# EAGLE design 11_RCL (EAGLE 7.5.0)
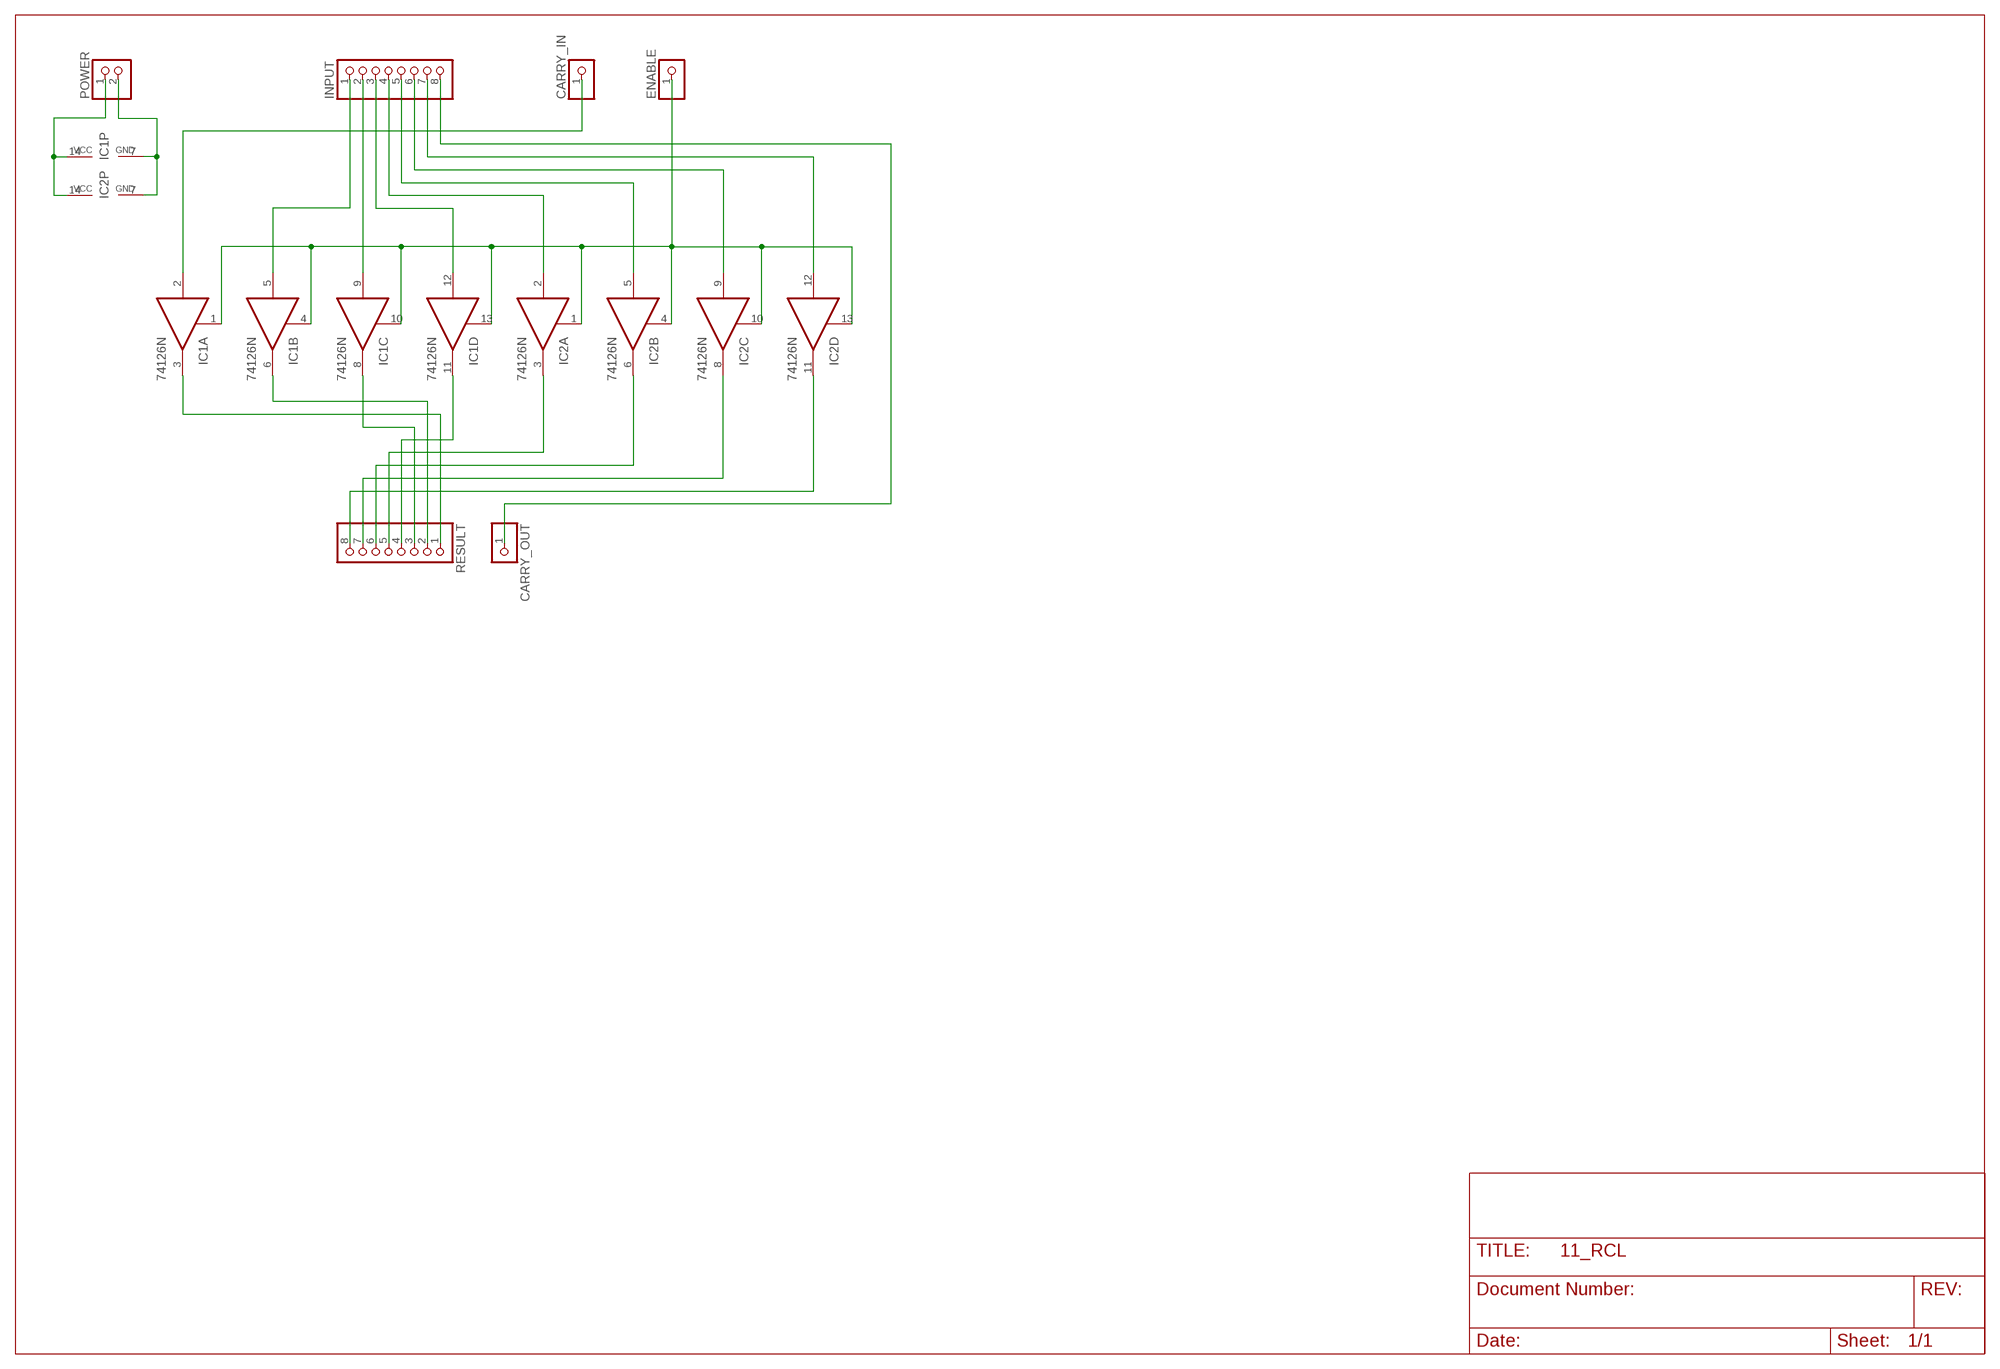
[diagram p0: schematic, sheet 1]

## Parts
CARRY_IN  PINHD-1X1  [1X01]
CARRY_OUT  PINHD-1X1  [1X01]
ENABLE  PINHD-1X1  [1X01]
IC1  74126N  [DIL14]
IC2  74126N  [DIL14]
INPUT  PINHD-1X8  [1X08]
POWER  PINHD-1X2  [1X02]
RESULT  PINHD-1X8  [1X08]

## Nets
GND: IC1.7(P:GND) IC2.7(P:GND) POWER.2
N$1: CARRY_IN.1 IC1.2(A:I)
N$2: IC1.3(A:O) RESULT.1
N$3: IC1.5(B:I) INPUT.1
N$4: IC1.6(B:O) RESULT.2
N$5: IC1.9(C:I) INPUT.2
N$6: IC1.12(D:I) INPUT.3
N$7: IC2.2(A:I) INPUT.4
N$8: IC2.5(B:I) INPUT.5
N$9: IC2.9(C:I) INPUT.6
N$10: IC2.12(D:I) INPUT.7
N$11: IC1.8(C:O) RESULT.3
N$12: IC1.11(D:O) RESULT.4
N$13: IC2.3(A:O) RESULT.5
N$14: IC2.6(B:O) RESULT.6
N$15: IC2.8(C:O) RESULT.7
N$16: IC2.11(D:O) RESULT.8
N$17: CARRY_OUT.1 INPUT.8
N$18: ENABLE.1 IC1.1(A:OE) IC1.4(B:OE) IC1.10(C:OE) IC1.13(D:OE) IC2.1(A:OE) IC2.4(B:OE) IC2.10(C:OE) IC2.13(D:OE)
VCC: IC1.14(P:VCC) IC2.14(P:VCC) POWER.1

## Library data of the parts
CARRY_IN CARRY_OUT ENABLE = pinhead:PINHD-1X1: PIN HEADER
IC1 IC2 = 74xx-eu:74*126: Quad bus BUFFER, 3-state
INPUT RESULT = pinhead:PINHD-1X8: PIN HEADER
POWER = pinhead:PINHD-1X2: PIN HEADER

## Board
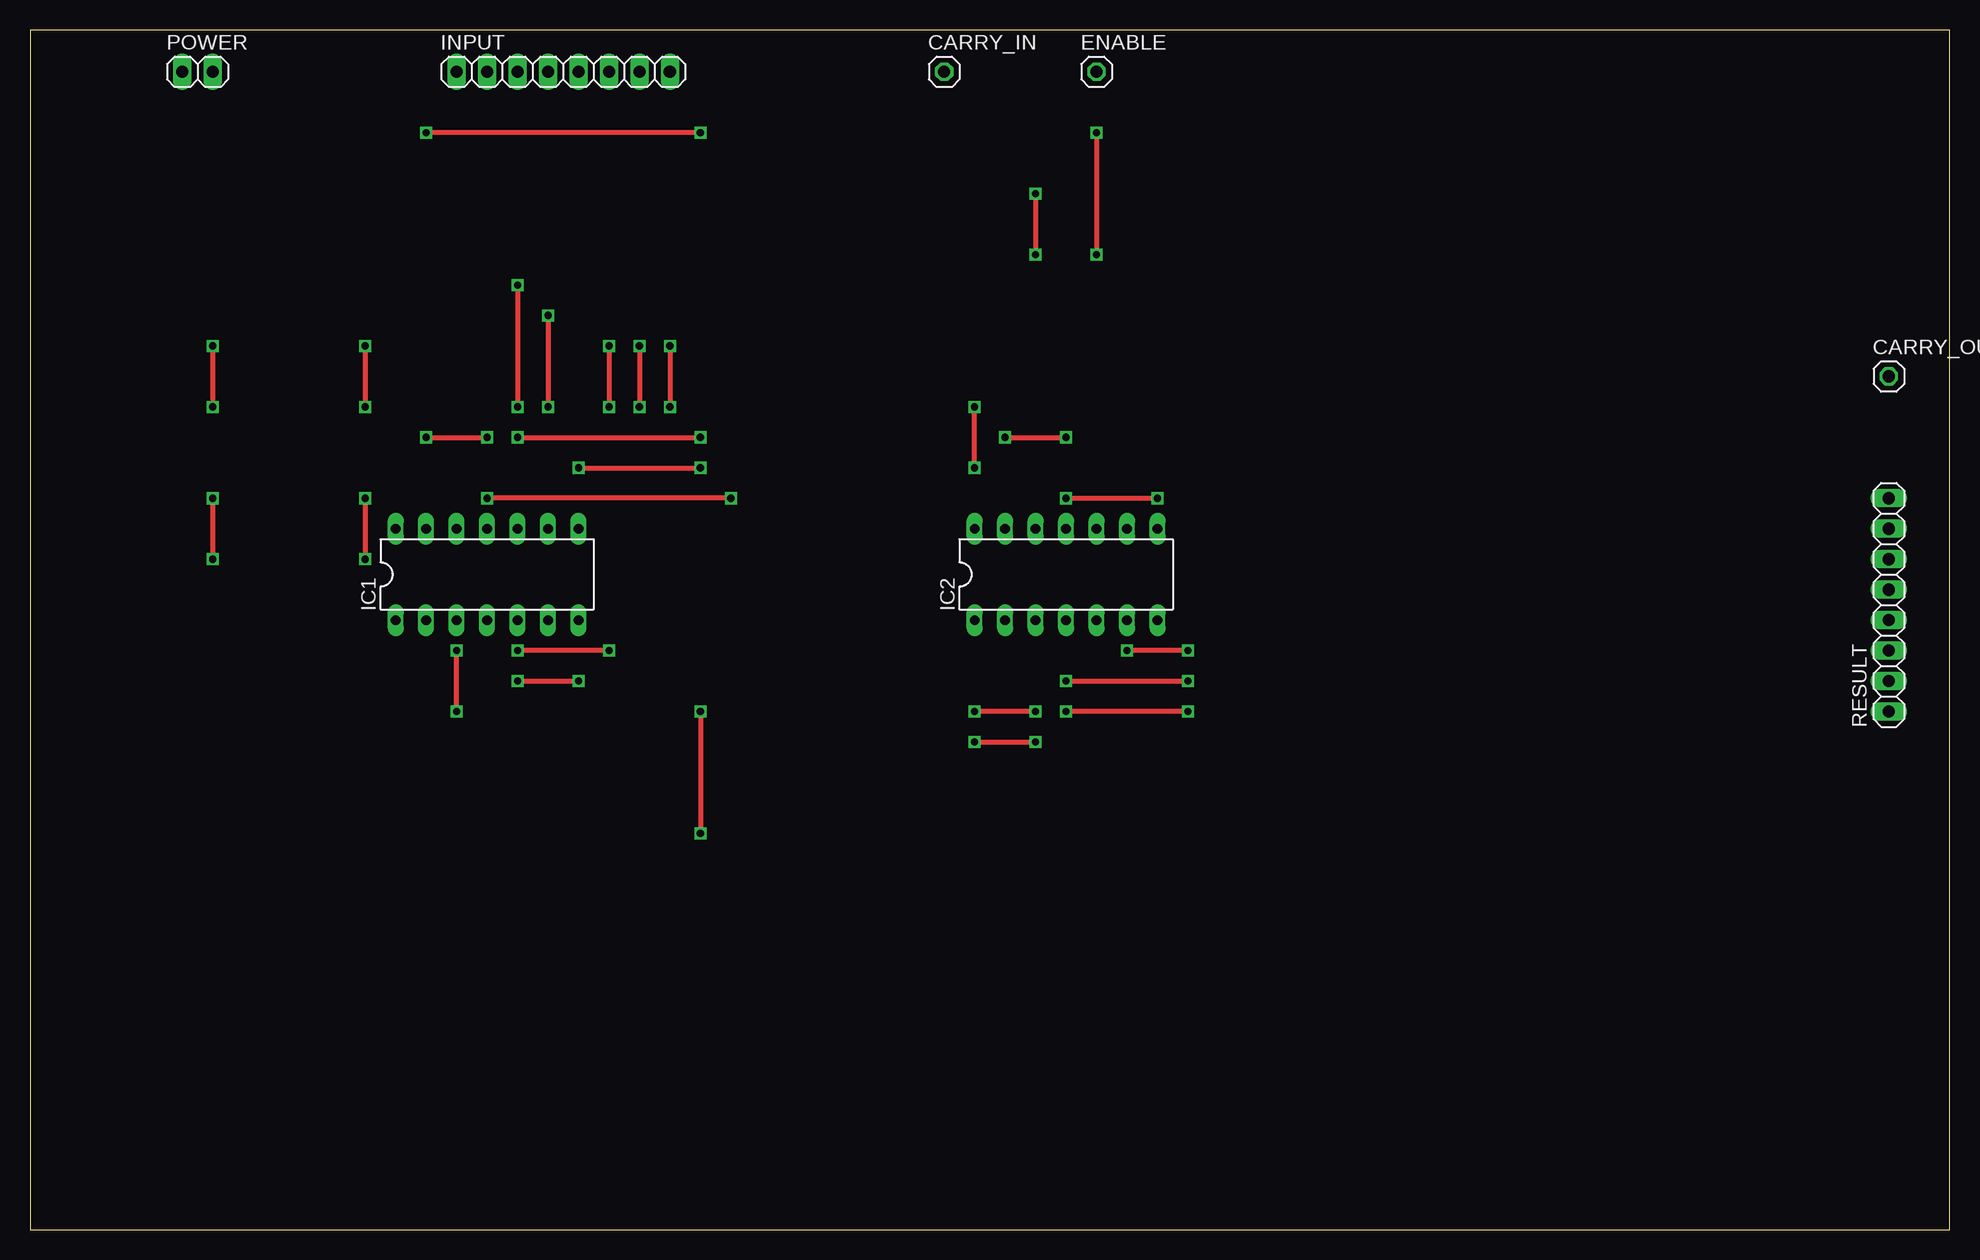
[diagram p1: board, top side]
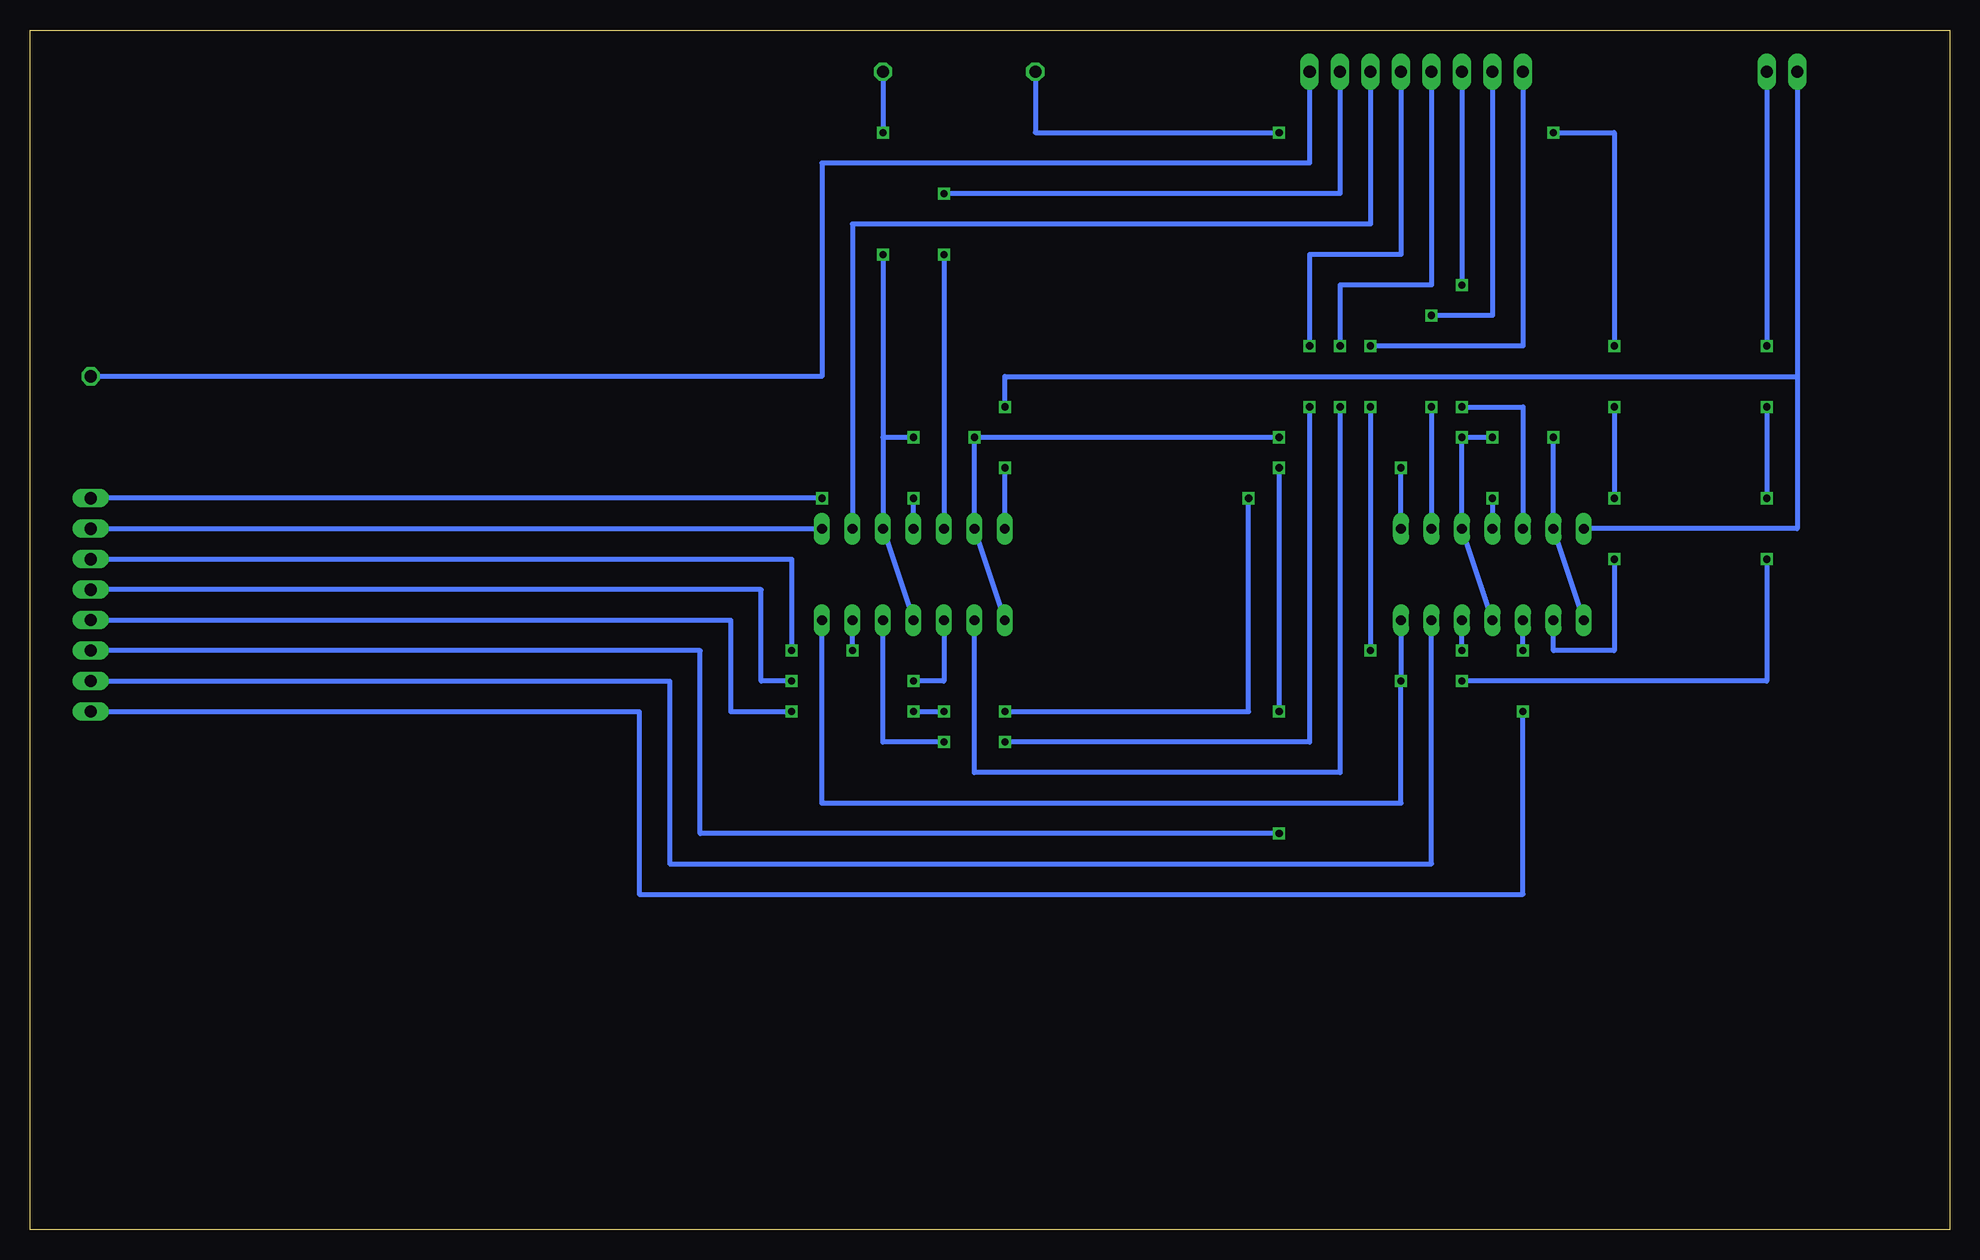
[diagram p2: board, bottom side, seen from below]

Size 160 x 100 mm. Coordinates in mm from the lower left corner, seen from the top.
Outline: 0,0 160,0 160,100 0,100 0,0
Copper layers (1*16): Top 0.035mm / dielectric 1.5mm / Bottom 0.035mm
Design rules "default": minimum track width 10mil, minimum drill 24mil, track to track 8mil, track to pad 8mil, pad to pad 8mil, via to via 8mil, smd to smd 8mil, copper to edge 40mil, drill to drill 8mil, minimum pad ring 10mil, minimum via ring 8mil, stop-mask expansion 4mil, vias tented up to drill 0mil, thermal gap 10mil

### Footprints (pad centres in the part's own frame; a part is rotated, then mirrored left to right if it is on the bottom)
1X01 = drill 1.016 octagon: 1 0,0
DIL14 = drill 0.813 long: 1 -7.62,-3.81; 2 -5.08,-3.81; 3 -2.54,-3.81; 4 0,-3.81; 5 2.54,-3.81; 6 5.08,-3.81; 7 7.62,-3.81; 8 7.62,3.81; 9 5.08,3.81; 10 2.54,3.81; 11 0,3.81; 12 -2.54,3.81; 13 -5.08,3.81; 14 -7.62,3.81
1X08 = drill 1.016 long: 1 -8.89,0; 2 -6.35,0; 3 -3.81,0; 4 -1.27,0; 5 1.27,0; 6 3.81,0; 7 6.35,0; 8 8.89,0
1X02 = drill 1.016 long: 1 -1.27,0; 2 1.27,0

### Placement (x,y rotation side)
CARRY_IN  76.2,96.52 0 top
CARRY_OUT  154.94,71.12 0 top
ENABLE  88.9,96.52 0 top
IC1  38.1,54.61 0 top
IC2  86.36,54.61 0 top
INPUT  44.45,96.52 0 top
POWER  13.97,96.52 0 top
RESULT  154.94,52.07 90 top

### Tracks (layer width: path | path; a pad name or v marks a point on that pad's centre or on a via)
GND  (via drill 0.6)
  Top 0.406: v15.24,73.66 v15.24,68.58 | v15.24,60.96 v15.24,55.88 | v40.64,45.72 v45.72,45.72
  Bottom 0.406: POWER.2 v15.24,73.66 | v15.24,68.58 v15.24,60.96 | v15.24,55.88 15.24,45.72 v40.64,45.72 | IC2.7 93.98,35.56 45.72,35.56 v45.72,45.72 IC1.7
N$1  (via drill 0.6)
  Top 0.406: v55.88,91.44 v33.02,91.44 | v27.94,73.66 v27.94,68.58 | v27.94,60.96 v27.94,55.88
  Bottom 0.406: CARRY_IN.1 76.2,91.44 v55.88,91.44 | v33.02,91.44 27.94,91.44 v27.94,73.66 | v27.94,68.58 v27.94,60.96 | v27.94,55.88 27.94,48.26 33.02,48.26 IC1.2
N$2  (via drill 0.6)
  Top 0.406: v35.56,43.18 v35.56,48.26
  Bottom 0.406: RESULT.1 109.22,43.18 109.22,27.94 35.56,27.94 v35.56,43.18 | v35.56,48.26 IC1.3
N$3  (via drill 0.6)
  Top 0.406: v48.26,73.66 v48.26,68.58 | v48.26,48.26 v40.64,48.26
  Bottom 0.406: INPUT.1 35.56,73.66 v48.26,73.66 | v48.26,68.58 v48.26,48.26 | v40.64,48.26 IC1.5
N$4
  Bottom 0.406: RESULT.2 106.68,45.72 106.68,30.48 43.18,30.48 IC1.6
N$5  (via drill 0.6)
  Top 0.406: v43.18,76.2 v43.18,68.58
  Bottom 0.406: INPUT.2 38.1,76.2 v43.18,76.2 | v43.18,68.58 IC1.9
N$6  (via drill 0.6)
  Top 0.406: v40.64,78.74 v40.64,68.58
  Bottom 0.406: INPUT.3 v40.64,78.74 | v40.64,68.58 35.56,68.58 IC1.12
N$7  (via drill 0.6)
  Top 0.406: v50.8,73.66 v50.8,68.58
  Bottom 0.406: INPUT.4 43.18,78.74 50.8,78.74 v50.8,73.66 | v50.8,68.58 50.8,38.1 81.28,38.1 IC2.2
N$8  (via drill 0.6)
  Top 0.406: v53.34,73.66 v53.34,68.58 | v78.74,40.64 v83.82,40.64
  Bottom 0.406: INPUT.5 45.72,81.28 53.34,81.28 v53.34,73.66 | v53.34,68.58 53.34,40.64 v78.74,40.64 | v83.82,40.64 88.9,40.64 IC2.5
N$9
  Bottom 0.406: INPUT.6 48.26,83.82 91.44,83.82 IC2.9
N$10  (via drill 0.6)
  Top 0.406: v83.82,86.36 v83.82,81.28
  Bottom 0.406: INPUT.7 50.8,86.36 v83.82,86.36 | v83.82,81.28 IC2.12
N$11  (via drill 0.6)
  Top 0.406: v45.72,63.5 v55.88,63.5 | v55.88,43.18 v55.88,33.02
  Bottom 0.406: IC1.8 v45.72,63.5 | v55.88,63.5 v55.88,43.18 | v55.88,33.02 104.14,33.02 104.14,48.26 RESULT.3
N$12  (via drill 0.6)
  Top 0.406: v96.52,43.18 v86.36,43.18 | v83.82,43.18 v78.74,43.18 | v58.42,60.96 v38.1,60.96
  Bottom 0.406: RESULT.4 101.6,50.8 101.6,43.18 v96.52,43.18 | v86.36,43.18 v83.82,43.18 | v78.74,43.18 58.42,43.18 v58.42,60.96 | v38.1,60.96 IC1.11
N$13  (via drill 0.6)
  Top 0.406: v86.36,45.72 v96.52,45.72
  Bottom 0.406: IC2.3 83.82,45.72 v86.36,45.72 | v96.52,45.72 99.06,45.72 99.06,53.34 RESULT.5
N$14  (via drill 0.6)
  Top 0.406: v96.52,48.26 v91.44,48.26
  Bottom 0.406: RESULT.6 96.52,55.88 v96.52,48.26 | v91.44,48.26 IC2.6
N$15
  Bottom 0.406: RESULT.7 IC2.8
N$16  (via drill 0.6)
  Top 0.406: v86.36,60.96 v93.98,60.96
  Bottom 0.406: IC2.11 v86.36,60.96 | v93.98,60.96 RESULT.8
N$17
  Bottom 0.406: INPUT.8 53.34,88.9 93.98,88.9 93.98,71.12 CARRY_OUT.1
N$18  (via drill 0.6)
  Top 0.406: v88.9,91.44 v88.9,81.28 | v81.28,66.04 v86.36,66.04 | v33.02,66.04 v38.1,66.04 | v40.64,66.04 v55.88,66.04
  Bottom 0.406: ENABLE.1 v88.9,91.44 | v88.9,81.28 88.9,66.04 | 88.9,66.04 IC2.10 IC2.4 | v86.36,66.04 88.9,66.04 | IC2.1 IC2.13 v81.28,66.04 v55.88,66.04 | IC1.4 IC1.10 v40.64,66.04 v38.1,66.04 | IC1.1 IC1.13 v33.02,66.04
VCC  (via drill 0.6)
  Top 0.406: v78.74,63.5 v78.74,68.58
  Bottom 0.406: POWER.1 12.7,71.12 | 12.7,71.12 12.7,58.42 IC1.14 | 12.7,71.12 78.74,71.12 v78.74,68.58 | IC2.14 v78.74,63.5